# Altium schematic sheet Opioid - IO - rev.A0.SchDoc
size A4
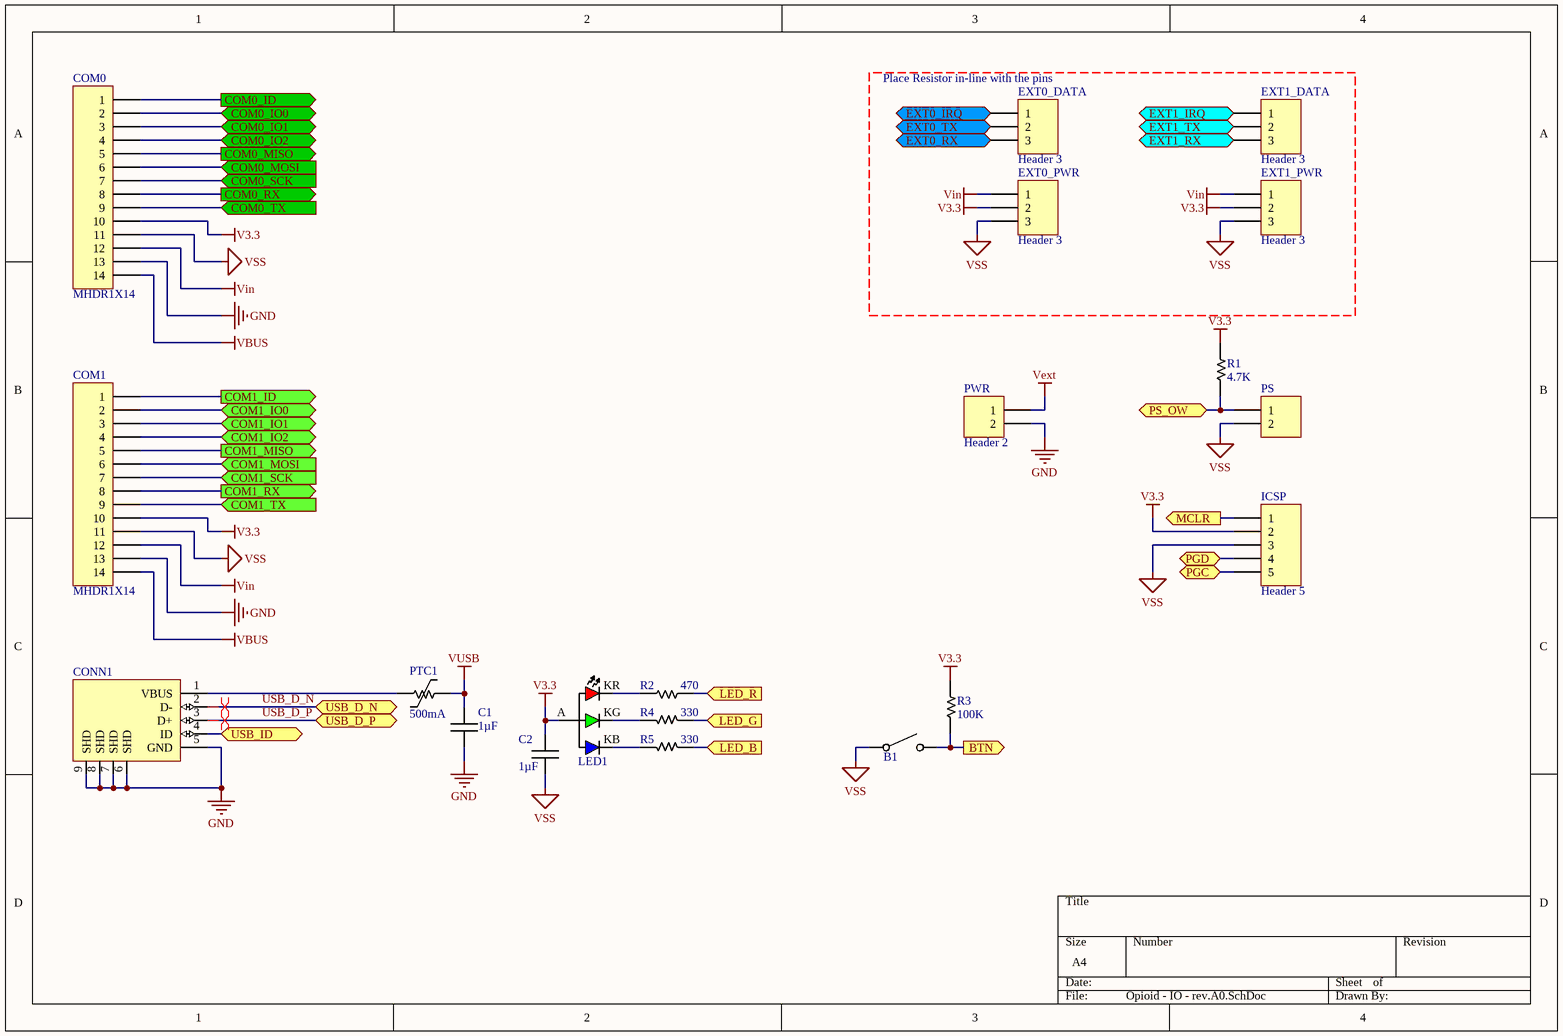
[diagram p0: Opioid - IO - rev.A0.SchDoc]

## Parts
B1  Tact Button NO  [Tact TH 4pin 6×6mm]  (value not drawn)
C1  1µF  [CAPC1608N]
C2  1µF  [CAPC1608N]
COM0  MHDR1X14  [MHDR1X14]
COM1  MHDR1X14  [MHDR1X14]
CONN1  USB-Conn Mini-B SMD  [440478]  (value not drawn)
EXT0_DATA  Header 3  [HDR1X3]
EXT0_PWR  Header 3  [HDR1X3]
EXT1_DATA  Header 3  [HDR1X3]
EXT1_PWR  Header 3  [HDR1X3]
ICSP  Header 5  [HDR1X5]
LED1  LED RGB common A  [LED 3528m]  (value not drawn)
PS  MHDR1X2  [MHDR1X2]  (value not drawn)
PTC1  500mA  [RESC3225N]
PWR  Header 2  [HDR1X2]
R1  4.7K  [RESC1608N]
R2  470  [RESC1608N]
R3  100K  [RESC1608N]
R4  330  [RESC1608N]
R5  330  [RESC1608N]

## Ports
BTN (out), COM0_ID (out), COM0_IO0 (bidir), COM0_IO1 (bidir), COM0_IO2 (bidir), COM0_MISO (out), COM0_MOSI (in), COM0_RX (out), COM0_SCK (in), COM0_TX (in), COM1_ID (out), COM1_IO0 (bidir), COM1_IO1 (bidir), COM1_IO2 (bidir), COM1_MISO (out), COM1_MOSI (in), COM1_RX (out), COM1_SCK (in), COM1_TX (in), EXT0_IRQ (bidir), EXT0_RX (out), EXT0_TX (in), EXT1_IRQ (bidir), EXT1_RX (out), EXT1_TX (in), LED_B (in), LED_G (in), LED_R (in), MCLR (out), PGC (bidir), PGD (bidir), PS_OW (bidir), USB_D_N (bidir), USB_D_P (bidir), USB_ID (bidir)

## Nets
GND: C1.1 COM0.13 COM1.13 CONN1.5(GND) CONN1.6(SHD) CONN1.7(SHD) CONN1.8(SHD) CONN1.9(SHD) PWR.2
V3.3: C2.2 COM0.10 COM1.10 EXT0_PWR.2 EXT1_PWR.2 ICSP.2 LED1.A R1.2 R3.2
VBUS: COM0.14 COM1.14
Vext: PWR.1
Vin: COM0.12 COM1.12 EXT0_PWR.1 EXT1_PWR.1
VSS: B1.1 C2.1 COM0.11 COM1.11 EXT0_PWR.3 EXT1_PWR.3 ICSP.3 PS.2
VUSB: C1.2 PTC1.2
BTN: B1.2 R3.1 ; port BTN
COM0_ID: COM0.1 ; port COM0_ID
COM0_IO0: COM0.2 ; port COM0_IO0
COM0_IO1: COM0.3 ; port COM0_IO1
COM0_IO2: COM0.4 ; port COM0_IO2
COM0_MISO: COM0.5 ; port COM0_MISO
COM0_MOSI: COM0.6 ; port COM0_MOSI
COM0_RX: COM0.8 ; port COM0_RX
COM0_SCK: COM0.7 ; port COM0_SCK
COM0_TX: COM0.9 ; port COM0_TX
COM1_ID: COM1.1 ; port COM1_ID
COM1_IO0: COM1.2 ; port COM1_IO0
COM1_IO1: COM1.3 ; port COM1_IO1
COM1_IO2: COM1.4 ; port COM1_IO2
COM1_MISO: COM1.5 ; port COM1_MISO
COM1_MOSI: COM1.6 ; port COM1_MOSI
COM1_RX: COM1.8 ; port COM1_RX
COM1_SCK: COM1.7 ; port COM1_SCK
COM1_TX: COM1.9 ; port COM1_TX
EXT0_IRQ: EXT0_DATA.1 ; port EXT0_IRQ
EXT0_RX: EXT0_DATA.3 ; port EXT0_RX
EXT0_TX: EXT0_DATA.2 ; port EXT0_TX
EXT1_IRQ: EXT1_DATA.1 ; port EXT1_IRQ
EXT1_RX: EXT1_DATA.3 ; port EXT1_RX
EXT1_TX: EXT1_DATA.2 ; port EXT1_TX
LED_B: R5.2 ; port LED_B
LED_G: R4.2 ; port LED_G
LED_R: R2.2 ; port LED_R
MCLR: ICSP.1 ; port MCLR
PGC: ICSP.5 ; port PGC
PGD: ICSP.4 ; port PGD
PS_OW: PS.1 R1.1 ; port PS_OW
USB_D_N: CONN1.2(D-) ; port USB_D_N
USB_D_P: CONN1.3(D+) ; port USB_D_P
USB_ID: CONN1.4(ID) ; port USB_ID
NetCONN1_1: CONN1.1(VBUS) PTC1.1
NetLED1_KB: LED1.KB R5.1
NetLED1_KG: LED1.KG R4.1
NetLED1_KR: LED1.KR R2.1

## Layout directives
differential pair: USB_D_N, USB_D_P

## Notes on the sheet
- (near EXT0_DATA) Place Resistor in-line with the pins

## Library data of the parts
B1 = Tact Button NO: pin to pad: 1>1+2 2>3+4
C1 C2 = Capacitor: Value: 1µF
COM0 COM1 = MHDR1X14: Header, 14-Pin; LatestRevisionDate: 17-Jul-2002; LatestRevisionNote: Re-released for DXP Platform.; Publisher: Altium Limited
EXT0_DATA EXT0_PWR EXT1_DATA EXT1_PWR = Header 3: Header, 3-Pin; LatestRevisionDate: 17-Jul-2002; LatestRevisionNote: Re-released for DXP Platform.; Publisher: Altium Limited
ICSP = Header 5: Header, 5-Pin; LatestRevisionDate: 17-Jul-2002; LatestRevisionNote: Re-released for DXP Platform.; Publisher: Altium Limited
LED1 = LED RGB common A: pin to pad: A>2 KB>3 KG>4 KR>1
PS = MHDR1X2: Header, 2-Pin; LatestRevisionDate: 17-Jul-2002; LatestRevisionNote: Re-released for DXP Platform.; Publisher: Altium Limited
PTC1 = PTC: Trip_Current: 500mA
PWR = Header 2: Header, 2-Pin; LatestRevisionDate: 17-Jul-2002; LatestRevisionNote: Re-released for DXP Platform.; Publisher: Altium Limited
R1-R5 = Resistor
  R1: Value: 4.7K
  R2: Value: 470
  R3: Value: 100K
  R4 R5: Value: 330